# Altium schematic sheet WX0.008.959DL.SchDoc: 民用NB-IoT物联网通用膜式燃气表主控板原理图1
size A3; Date: 2022/4/25; DocumentNumber: WX0.008.316; Revision: V1; SheetNumber: 1; SheetTotal: 2
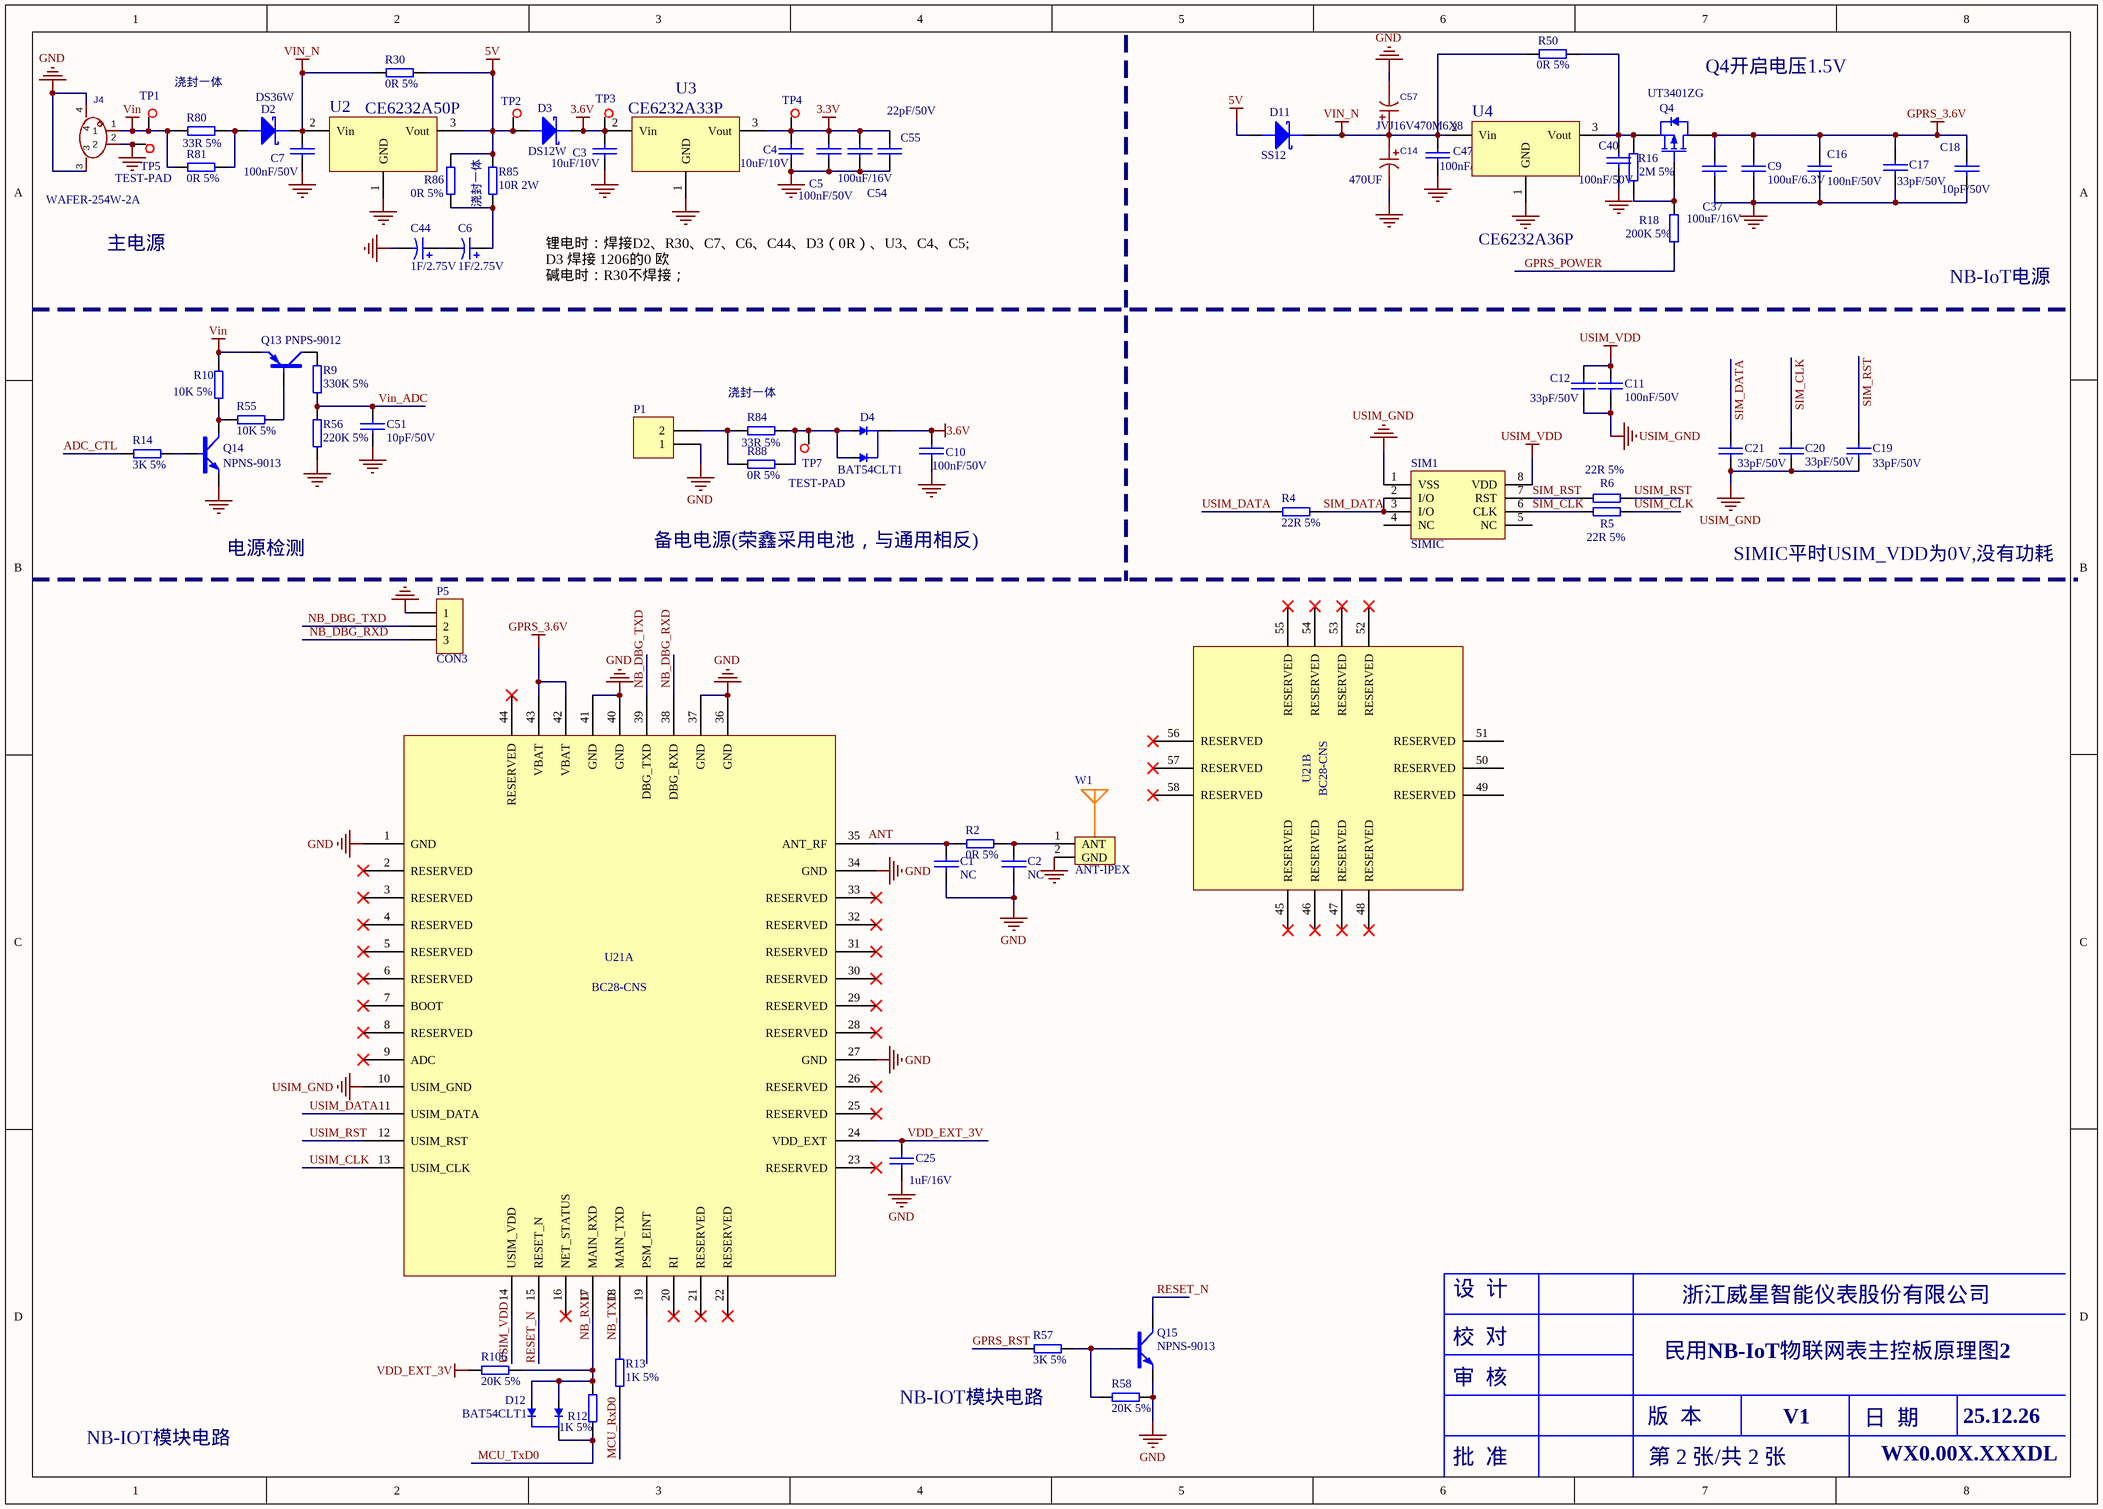
[diagram p0: WX0.008.959DL.SchDoc]

## Parts
C1  NC  [CAP0402]
C2  NC  [CAP0402]
C3  10uF/10V  [CAP0603]
C4  10uF/10V  [CAP0603]
C5  100nF/50V  [CAP0603]
C6  1F/2.75V  [CAPPC_350_800_1600]
C7  100nF/50V  [CAP0603]
C9  100uF/6.3V  [GRM1206]
C10  100nF/50V  [CAP0603]
C11  100nF/50V  [CAP0603]
C12  33pF/50V  [CAP0603]
C14  470UF  [CAP-SMD_BD6.3-L6.6-W6.6-LS7.3-FD-H7.7]
C16  100nF/50V  [CAP0603]
C17  33pF/50V  [CAP0603]
C18  10pF/50V  [CAP0603]
C19  33pF/50V  [CAP0603]
C20  33pF/50V  [CAP0603]
C21  33pF/50V  [CAP0603]
C25  1uF/16V  [CAP0603]
C37  100uF/16V  [GRM1206]
C40  100nF/50V  [CAP0603]
C44  1F/2.75V  [CAPPC_350_800_1600]
C47  100nF/50V  [CAP0603]
C51  10pF/50V  [CAP0603]
C54  100uF/16V  [GRM1206]
C55  22pF/50V  [CAP0603]
C57  JVJ16V470M6X8  [CAP-SMD_BD6.3-L6.6-W6.6-LS7.3-FD-H7.7]
D2  DS36W  [SOD-123FL]
D3  DS12W  [SOD-123FL]
D4  BAT54CLT1  [SOT-23]
D11  SS12  [DO-214AC]
D12  BAT54CLT1  [SOT-23]
J4  WAFER-254W-2A  [XH 2.54]
P1  (no value)  [SMT2-2.0]
P5  CON3  [SIP-3]
Q4  UT3401ZG  [SOT-23]
Q13  PNPS-9012  [SOT-23]
Q14  NPNS-9013  [SOT-23]
Q15  NPNS-9013  [SOT-23]
R2  0R 5%  [RES0603]
R4  22R 5%  [RES0603]
R5  22R 5%  [RES0603]
R6  22R 5%  [RES0603]
R9  330K 5%  [RES0603]
R10  10K 5%  [RES0603]
R12  1K 5%  [RES0603]
R13  1K 5%  [RES0603]
R14  3K 5%  [RES0603]
R16  2M 5%  [RES0603]
R18  200K 5%  [RES0603]
R30  0R 5%  [RES1206]
R50  0R 5%  [RES1206]
R55  10K 5%  [RES0603]
R56  220K 5%  [RES0603]
R57  3K 5%  [RES0603]
R58  20K 5%  [RES0603]
R80  33R 5%  [金属膜电阻]
R81  0R 5%  [RES1206]
R84  33R 5%  [金属膜电阻]
R85  10R 2W  [金属膜电阻]
R86  0R 5%  [RES1206]
R88  0R 5%  [RES1206]
R106  20K 5%  [RES0603]
SIM1  SIMIC  [SIMIC]
TP1  TEST-PAD  [TEST-PAD]  (value not drawn)
TP2  TEST-PAD  [TEST-PAD]  (value not drawn)
TP3  TEST-PAD  [TEST-PAD]  (value not drawn)
TP4  TEST-PAD  [TEST-PAD]  (value not drawn)
TP5  TEST-PAD  [TEST-PAD]
TP7  TEST-PAD  [TEST-PAD]
U2  CE6232A50P  [SOT-89]
U3  CE6232A33P  [SOT-89]
U4  CE6232A36P  [SOT-89]
U21  BC28-CNS  [BC28-CNS]  (parts A,B of 2)
W1  ANT-IPEX  [ANT-IPEX]

## Nets
3.3V: C4.1 C5.1 C54.1 C55.1 TP4.1 U3.3(Vout)
3.6V: C3.1 C10.1 D3.2 D4.3(C) TP3.1 U3.2(Vin)
5V: D3.1 D11.1 R30.2 R85.2 R86.2 TP2.1 U2.3(Vout)
GND: C1.1 C2.1 C3.2 C4.2 C5.2 C7.2 C9.2 C10.2 C14.2 C16.2 C17.2 C18.2 C25.2 C37.2 C40.2 C44.2 C47.2 C51.1 C54.2 C55.2 C57.2 J4.2 J4.3 J4.4 P1.1 P5.1 Q14.2(E) Q15.2(E) R56.2 R58.2 TP5.1 U2.1(GND) U3.1(GND) U4.1(GND) U21.1(GND) U21.27(GND) U21.34(GND) U21.36(GND) U21.37(GND) U21.40(GND) U21.41(GND) W1.2(GND)
GPRS_3.6V: C9.1 C16.1 C17.1 C18.1 C37.1 Q4.3(D) U21.42(VBAT) U21.43(VBAT)
USIM_GND: C11.2 C12.2 C19.2 C20.2 C21.2 SIM1.1(VSS) U21.10(USIM_GND)
USIM_VDD: C11.1 C12.1 SIM1.8(VDD) U21.14(USIM_VDD)
VDD_EXT_3V: C25.1 R106.1 U21.24(VDD_EXT)
Vin: J4.1 Q13.2(E) R10.2 R80.1 R81.1 TP1.1
VIN_N: C7.1 C14.1 C47.1 C57.1 D2.2 D11.2 R30.1 R50.1 U2.2(Vin) U4.2(Vin)
ADC_CTL: R14.1
GPRS_POWER: R18.1
GPRS_RST: R57.1
MCU_RxD0: R13.1
MCU_TxD0: D12.3(C) R12.2
NB_DBG_RXD: P5.3 U21.38(DBG_RXD)
NB_DBG_TXD: P5.2 U21.39(DBG_TXD)
NB_RXD: D12.1(A) D12.2(A) R12.1 R106.2 U21.17(MAIN_RXD)
NB_TXD: R13.2 U21.18(MAIN_TXD)
RESET_N: Q15.3(C) U21.15(RESET_N)
SIM_CLK: C20.1 R5.1 SIM1.6(CLK)
SIM_DATA: C21.1 R4.2 SIM1.2(I/O) SIM1.3(I/O)
SIM_RST: C19.1 R6.1 SIM1.7(RST)
USIM_CLK: R5.2 U21.13(USIM_CLK)
USIM_DATA: R4.1 U21.11(USIM_DATA)
USIM_RST: R6.2 U21.12(USIM_RST)
Vin_ADC: C51.2 R9.2 R56.1
NetC1_2: C1.2 R2.1 U21.35(ANT_RF)
NetC2_2: C2.2 R2.2 W1.1(ANT)
NetC6_1: C6.1 R85.1 R86.1
NetC6_2: C6.2 C44.1
NetC40_1: C40.1 Q4.2(S) R16.2 R50.2 U4.3(Vout)
NetD2_1: D2.1 R80.2 R81.2
NetD4_1: D4.1(A) D4.2(A) R84.2 R88.2 TP7.1
NetP1_2: P1.2 R84.1 R88.1
NetQ4_1: Q4.1(G) R16.1 R18.2
NetQ13_1: Q13.1(B) R55.2
NetQ13_3: Q13.3(C) R9.1
NetQ14_1: Q14.1(B) R14.2
NetQ14_3: Q14.3(C) R10.1 R55.1
NetQ15_1: Q15.1(B) R57.2 R58.1

Not connected (* = marked no-connect by the designer): SIM1 4(NC) 5(NC); U21 2(RESERVED)* 3(RESERVED)* 4(RESERVED)* 5(RESERVED)* 6(RESERVED)* 7(BOOT)* 8(RESERVED)* 9(ADC)* 16(NET_STATUS)* 19(PSM_EINT) 20(RI)* 21(RESERVED)* 22(RESERVED)* 23(RESERVED)* 25(RESERVED)* 26(RESERVED)* 28(RESERVED)* 29(RESERVED)* 30(RESERVED)* 31(RESERVED)* 32(RESERVED)* 33(RESERVED)* 44(RESERVED)* 45(RESERVED)* 46(RESERVED)* 47(RESERVED)* 48(RESERVED)* 49(RESERVED) 50(RESERVED) 51(RESERVED) 52(RESERVED)* 53(RESERVED)* 54(RESERVED)* 55(RESERVED)* 56(RESERVED)* 57(RESERVED)* 58(RESERVED)*

## Notes on the sheet
- 浇封一体
- Q4开启电压1.5V
- (near R85) 浇封一体
- 主电源
- 锂电时：焊接D2、R30、C7、C6、C44、D3（0R）、U3、C4、C5; D3 焊接 1206的0 欧
  碱电时：R30不焊接；
- NB-IoT电源
- (near R84) 浇封一体
- 电源检测
- 备电电源(荣鑫采用电池，与通用相反)
- SIMIC平时USIM_VDD为0V,没有功耗
- 设  计
- 浙江威星智能仪表股份有限公司
- 审  核
- 校  对
- 民用NB-IoT物联网表主控板原理图2
- NB-IOT模块电路
- 版  本
- V1
- 日  期
- WX0.00X.XXXDL
- 25.12.26
- 批  准
- 第 2 张/共 2 张
- Labels drawn without touching a wire or pin: ANT
- 设   计
- 校   对
- 邓琴琴
- 冯翰
- 审   核
- 标准化
- 版本
- 日期
- 批   准
- 刘晓峰
- 第       张  /  共       张

## Library data of the parts
C1 C2 = 101020103-0005: Part Name: 0603贴片电容; ID: 11; SMD/DIP: SMD; Part Number: 101020103-0005
C3 C4 = 101020103-0026: 106pF,10 V,±10%,0603,村田,GRM188R61A106KE47D; Part Name: 0603贴片电容; ID: 8; SMD/DIP: SMD; Part Number: 101020103-0026
C5 C7 C10 C11 C16 C40 C47 = 101020103-0021: 104pF,50 V,±10%,0603,国巨,CC0603KRX7R9BB104; Part Name: 0603贴片电容; ID: 3; SMD/DIP: SMD; Part Number: 101020103-0021
C6 C44 = 1010202-0015: 1F,2.75 V,-20%~+20%,8mm*16mm,红宝石,2.7 DMC 1 M MY4 8X16; Part Name: 法拉电容; ID: 12; SMD/DIP: DIP; Part Number: 1010202-0015
C9 = 101020101-0020: 100uF,6.3 V,±20%,1206,村田,GRM31CR60J107ME39L; Part Name: 贴片电容; ID: 27; SMD/DIP: SMD; Part Number: 101020101-0020
C12 C17 C19-C21 = 101020103-0027: 33pF,50 V,±10%,0603,国巨,CC0603KRNPO9BN33; Part Name: 0603贴片电容; ID: 18; SMD/DIP: SMD; Part Number: 101020103-0027
C14 = JVJ16V470M6X8: 470UF,10v; Symbol: JVJ16V470M6X8
C18 C51 = 101020103-0014: 10pF,50 V,±5%,0603,X7R,国巨,CC0603JRNPO9BN100; Part Name: 0603贴片电容; ID: 7; SMD/DIP: SMD; Part Number: 101020103-0014
C25 = 101020103-0003: 105pF,16 V,±10%,0603,国巨,CC0603KRX7R7BB105; Part Name: 0603贴片电容; ID: 14; SMD/DIP: SMD; Part Number: 101020103-0003
C37 = 101020101-0005: Part Name: 1206贴片电容; ID: 9; SMD/DIP: SMD
C54 = 101020101-0005: 100u,16 V,±10%,1206,国巨,CC1206KRNPO7BN106P; Part Name: 1206贴片电容; ID: 9; SMD/DIP: SMD
C55 = 101020103-0009: 22pF,50 V,±5%,0603,国巨,CC0603JRNPO9BN22; Part Name: 0603贴片电容; ID: 16; SMD/DIP: SMD; Part Number: 101020103-0009
D2 = 101040101-0048: DS36W,SOD123-FL,3 A,42 V,60 V,浙江领晨科技有限公司,DS36W; Part Number: 101040101-0055; Part Name: 贴片肖特基; ID: 8; SMD/DIP: SMD
D3 = 101040101-0048: DS12W,SOD-123FL,1 A,0.55 V,20 V,领晨科技,DS12W; Part Name: 贴片肖特基; ID: 9; SMD/DIP: SMD; Part Number: 101040101-0048
D4 = 101040101-0038: BAT54CLT1，SOT23-3,SOT23-3,0.2 A,0.8 V,30 V,安森美,BAT54CLT1; Part Name: 贴片肖特基; ID: 31; SMD/DIP: SMD; Part Number: 101040101-0038
D11 = 101040101-0009: SS12,DO-214AC,1 A,0.55 V,20 V,昶鑫,SS12; Part Name: 贴片肖特基; ID: 13; SMD/DIP: SMD; Part Number: 101040101-0009
D12 = 101040101-0038: BAT54CLT1，SOT23-3,SOT23-3,0.2 A,0.8 V,30 V,安森美,BAT54CLT1; Part Name: 贴片肖特基; ID: 8; SMD/DIP: SMD; Part Number: 101040101-0038
P1 = 1010902-0105: 2.0-2AW,直插弯座，2PIN，脚间距2mm，带防翘起,公头,单排,2.0-2AW;直插弯座，2PIN,脚间距2mm，带防翘起; Part Name: PH座; ID: 11; SMD/DIP: DIP; Part Number: 1010902-0105
P5 = CON3: Connector
Q4 = 101040201-0013: UT3401ZG,P-MOS,SOT-23,UTC,UT3401ZG; Part Name: 功率MOS管; ID: 18; SMD/DIP: SMD; Part Number: 101040201-0013
Q13 = 101040201-0001: 9012,PNP,SOT-23,JCET;长电,S9012; Part Name: 贴片三极管; ID: 17; SMD/DIP: SMD; Part Number: 101040201-0001
Q14 Q15 = 101040201-0002: 9013,NPN,SOT-23,长电,S9013; Part Name: 贴片三极管; ID: 15; SMD/DIP: SMD; Part Number: 101040201-0002
R2 = 101010103-0001: 国巨,±5%,0603,,155 ℃,-55 ℃,RC0603J2-070RL,无铅,200 ppm/℃,1/10W,,0R; Part Name: 0603贴片电阻; ID: 1; SMD/DIP: SMD; Part Number: 101010103-0001
R4-R6 = 101010103-0009: 国巨,±5%,0603,,155 ℃,-55 ℃,RC0603JR-0722RL,无铅,200 ppm/℃,1/10W,,22欧; Part Name: 0603贴片电阻; ID: 17; SMD/DIP: SMD; Part Number: 101010103-0009
R9 = 101010103-0066: 330K,±5%,1/10W,0603,国巨,RC0603JR-07330KL; Part Name: 0603贴片电阻; ID: 31; SMD/DIP: SMD; Part Number: 101010103-0066
R10 R55 = 101010103-0003: 国巨,±5%,0603,,155 ℃,-55 ℃,RC0603JR-0710KL,无铅,200 ppm/℃,1/10W,,10K; Part Name: 0603贴片电阻; ID: 7; SMD/DIP: SMD; Part Number: 101010103-0003
R12 R13 R56 = 101010103-0044: 220K,±5%,1/10W,0603,国巨,RC0603JR-07220KL; Part Name: 0603贴片电阻; ID: 30; SMD/DIP: SMD; Part Number: 101010103-0044
R14 R57 = 101010103-0006: 国巨,±5%,0603,,155 ℃,-55 ℃,RC0603JR-073KL,无铅,100 ppm/℃,1/10W,,3K; Part Name: 0603贴片电阻; ID: 23; SMD/DIP: SMD; Part Number: 101010103-0006
R16 = 101010103-0025: 国巨,±5%,0603,,155 ℃,-55 ℃,RC0603JR-072ML,含铅,100 ppm/℃,1/10W,,2M; Part Name: 0603贴片电阻; ID: 20; SMD/DIP: SMD; Part Number: 101010103-0025
R18 = 101010103-0034: 200K,±5%,1/10W,0603,国巨,RC0603JR-07200KL; Part Name: 0603贴片电阻; ID: 13; SMD/DIP: SMD; Part Number: 101010103-0034
R30 R50 R81 R86 R88 = 101010101-0013: 0Ω,±5%,1/4W,1206,国巨,RC1206JR-070RL; Part Name: 1206贴片电阻; ID: 2; SMD/DIP: SMD; Part Number: 101010101-0013
R58 R106 = 101010103-0004: 国巨,±5%,0603,,155 ℃,-55 ℃,RC0603JR-0720KL,无铅,200 ppm/℃,1/10W,,20K; Part Name: 0603贴片电阻; ID: 15; SMD/DIP: SMD; Part Number: 101010103-0004
R80 R84 R85 = 101010103-0009: 国巨,±5%,0603,,155 ℃,-55 ℃,RC0603JR-0722RL,无铅,200 ppm/℃,1/10W,,22欧; Part Name: 0603贴片电阻; ID: 18; SMD/DIP: SMD; Part Number: 101010103-0009
SIM1 = AD_XN_SIMIC_01: SIMIC虚拟器件; ID: 20; SMD/DIP: SMD; Part Number: AD_XN_SIMIC_01; Part Name: SIMIC
TP1-TP5 TP7 = AD_WXHJ_TEST-PAD_01: 单面焊盘测试点; Part Name: 测试点; ID: 23; SMD/DIP: SMD; Part Number: AD_WXHJ_TEST-PAD_01
U2 = 1010503-0013: S-1206B50-U3,S-1206B50-U3,SOT89-3,6.5 V,1.7 V,0.2 V,5 V,250mA@VIN≧VOUT(S)＋1.0 V﹐1.5 V≦VOUT(S),1 uA,精工电子; Part Name: 贴片稳压器; ID: 6; SMD/DIP: SMD; Part Number: 1010503-0013
U3 = 1010503-0002: S-1206B33-U3T1G,S-1206B33-U3T1G,SOT89-3,6.5 V,1.7 V,0.15 V,3.3 V,250mA@VIN≧VOUT(S)＋1.0 V﹐1.5 V≦VOUT(S),1 uA,精工电子; Part Name: 线性稳压芯片; ID: 5; SMD/DIP: SMD; Part Number: 1010503-0002
U4 = 1010503-0031: CE6232A36P,CE6232A36P,SOT89-3,8 V,1.8 V,0.11 V,3.6 V,600mA,0.8 uA,南京芯力微电子有限公司; Part Name: 贴片稳压器; ID: 30; SMD/DIP: SMD; Part Number: 1010503-0031
U21 = BC28-CNS: BC28-CNS Moudle 58Pin 15.8X17.7mm H2.2mm RO; Manufacturer: Quectel; Geometry.Height: 2.2mm; Part Description: BC28-CNS Moudle 58Pin 15.8X17.7mm H2.2mm RO; Value: BC28-CNS
W1 = 1010902-0053: IPEX，配GPRS天线转接线; Part Name: IPEX座; ID: 2; SMD/DIP: DIP; Part Number: 1010902-0053
C57 = JVJ16V470M6X8: Symbol: JVJ16V470M6X8
J4 = WAFER-254W-2A: Symbol: WAFER-254W-2A